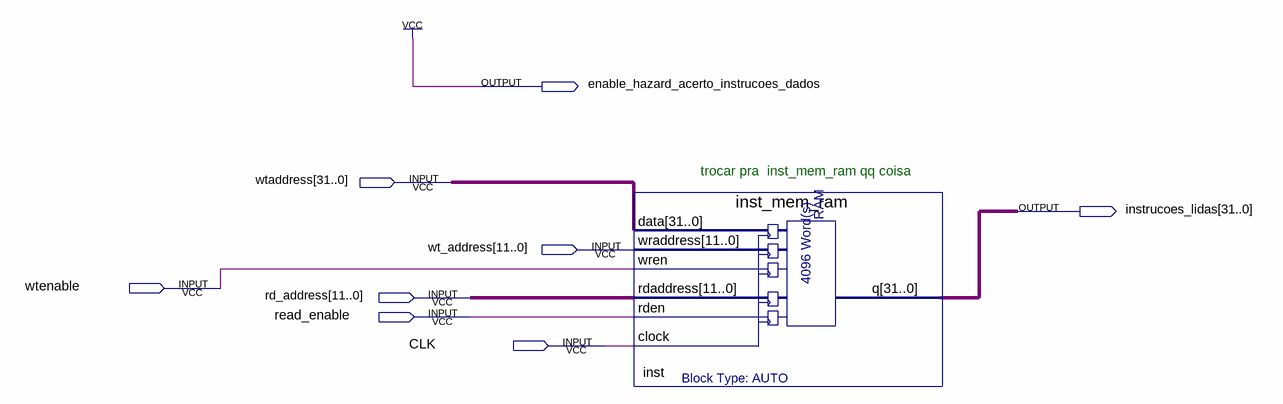
[diagram p0: schematic sheet]
// Quartus schematic instructionmemory.bdf as structural Verilog: 1 symbols, 8 pins
module instructionmemory (
  input  [31:0] wtaddress,
  input  [11:0] wt_address,
  input  wtenable,
  input  [11:0] rd_address,
  input  read_enable,
  input  CLK,
  output enable_hazard_acerto_instrucoes_dados,
  output [31:0] instrucoes_lidas
);

  inst_mem_ram inst (
    .data(wtaddress), .wraddress(wt_address), .wren(wtenable), .rdaddress(rd_address), .rden(read_enable),
    .clock(CLK), .q(instrucoes_lidas));

  assign enable_hazard_acerto_instrucoes_dados = 1'b1;

  // Notes on the sheet:
  //   trocar pra  inst_mem_ram qq coisa
endmodule
